# EAGLE design BTS_V2 (EAGLE 9.0.1)
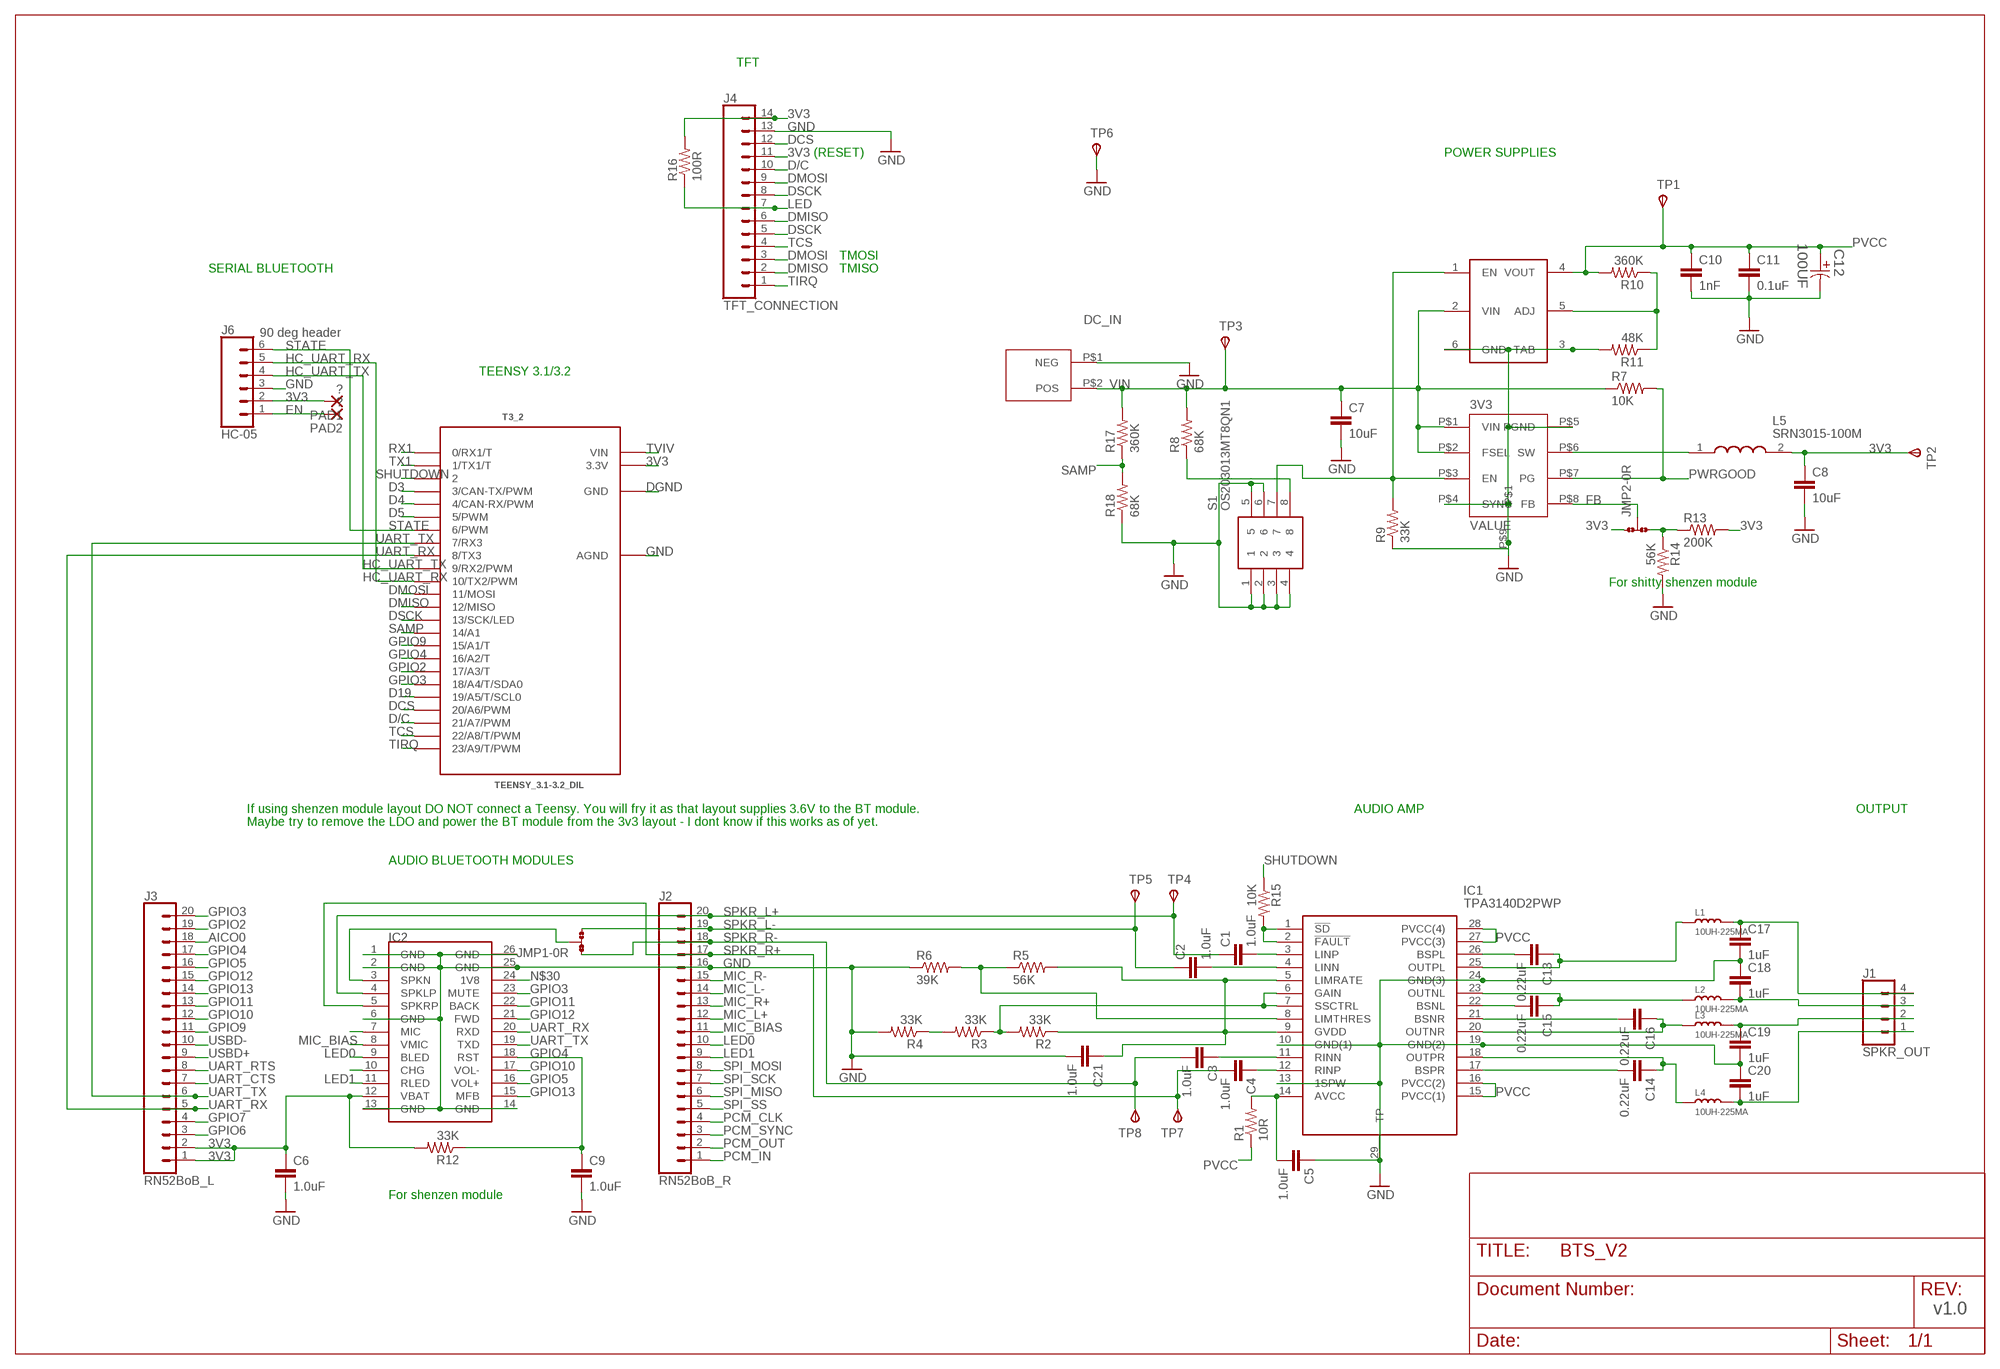
[diagram p0: schematic, sheet 1]

## Parts
3V3  ADP2370  [3MM_LFCSP_QFN]
C1  1.0uF  1.0UF-0603-16V-10%  [0603]
C2  1.0uF  1.0UF-0603-16V-10%  [0603]
C3  1.0uF  1.0UF-0603-16V-10%  [0603]
C4  1.0uF  1.0UF-0603-16V-10%  [0603]
C5  1.0uF  1.0UF-0603-16V-10%  [0603]
C6  1.0uF  1.0UF-0603-16V-10%  [0603]
C7  10uF  C-EUC3216  [C3216]
C8  10uF  C-EUC3216  [C3216]
C9  1.0uF  1.0UF-0603-16V-10%  [0603]
C10  1nF  1.0NF/1000PF-0603-50V-10%  [0603]
C11  0.1uF  0.1UF-0603-25V-(+80/-20%)  [0603]
C12  100UF  EEE-FK1C101P-CASE-D  [CAPAE660X610N]
C13  0.22uF  0.22UF-0603-50V-(-20/+80%)  [0603]
C14  0.22uF  0.22UF-0603-50V-(-20/+80%)  [0603]
C15  0.22uF  0.22UF-0603-50V-(-20/+80%)  [0603]
C16  0.22uF  0.22UF-0603-50V-(-20/+80%)  [0603]
C17  1uF  1.0NF/1000PF-0603-50V-10%  [0603]
C18  1uF  1.0NF/1000PF-0603-50V-10%  [0603]
C19  1uF  1.0NF/1000PF-0603-50V-10%  [0603]
C20  1uF  1.0NF/1000PF-0603-50V-10%  [0603]
C21  1.0uF  1.0UF-0603-16V-10%  [0603]
IC1  TPA3140D2PWP  [SOP65P640X120-29N]
IC2  BLK-MD-SPK-B  [BLK-MD-SPK-B]
J1  SPKR_OUT  CONN_04SCREW  [SCREWTERMINAL-3.5MM-4]
J2  RN52BoB_R  CONN_20  [1X20]
J3  RN52BoB_L  CONN_20  [1X20]
J4  TFT_CONNECTION  CONN_14  [1X14]
J6  HC-05  CONN_06SILK_FEMALE_PTH  [1X06]
JMP1  0R-JUMPA  [A0R-JMP]
JMP2  0R-JUMPA  [A0R-JMP]
L1  10UH-225MA  SMD-INDUCTOR-10UH-225MA-10%(0806)  [L0806]
L2  10UH-225MA  SMD-INDUCTOR-10UH-225MA-10%(0806)  [L0806]
L3  10UH-225MA  SMD-INDUCTOR-10UH-225MA-10%(0806)  [L0806]
L4  10UH-225MA  SMD-INDUCTOR-10UH-225MA-10%(0806)  [L0806]
L5  SRN3015-100M  [SRN3015]
PAD1  ?  SMD2  [SMD1,27-2,54]
PAD2  ?  SMD2  [SMD1,27-2,54]
R1  10R  R-US_R0603  [R0603]
R2  33K  R-US_R0603  [R0603]
R3  33K  R-US_R0603  [R0603]
R4  33K  R-US_R0603  [R0603]
R5  56K  R-US_R0603  [R0603]
R6  39K  R-US_R0603  [R0603]
R7  10K  R-US_R0603  [R0603]
R8  68K  R-US_R0603  [R0603]
R9  33K  R-US_R0603  [R0603]
R10  360K  R-US_R0603  [R0603]
R11  48K  R-US_R0603  [R0603]
R12  33K  R-US_R0603  [R0603]
R13  200K  R-US_R0603  [R0603]
R14  56K  R-US_R0603  [R0603]
R15  10K  R-US_R0603  [R0603]
R16  100R  R-US_R0603  [R0603]
R17  360K  R-US_R0603  [R0603]
R18  68K  R-US_R0603  [R0603]
S1  OS203013MT8QN1  [OS203013MT8QN1]
T3_2  TEENSY_3.1-3.2_DIL  [TEENSY_3.0-3.2&LC_DIL]
TP1  TPSPAD1-17  [P1-17]
TP2  TPSPAD1-17  [P1-17]
TP3  TPSPAD1-17  [P1-17]
TP4  TPSPAD1-17  [P1-17]
TP5  TPSPAD1-17  [P1-17]
TP6  TPSPAD1-17  [P1-17]
TP7  TPSPAD1-17  [P1-17]
TP8  TPSPAD1-17  [P1-17]
U$1  HK_XT-60  [HOBBYKING_XT-60]
U$2  NCP59302  [D2PAK-5]

## Nets
3V3: C6.1 C8.1 IC2.12(VBAT) J3.1 J3.2 J4.11 J4.14 J6.2 JMP2.1 L5.2 PAD1.1(P) R12.2 R13.2 R16.2 T3_2.3.3V TP2.TP(PP)
AICO0: J3.18
BSNL: C15.2 IC1.22(BSNL)
BSNR: C16.2 IC1.21(BSNR)
BSPL: C13.2 IC1.26(BSPL)
BSPR: C14.2 IC1.17(BSPR)
D3: T3_2.3(3/CAN-TX/PWM)
D4: T3_2.4(4/CAN-RX/PWM)
D5: T3_2.5(5/PWM)
D19: T3_2.19/A5(19/A5/T/SCL0)
D/C: J4.10 T3_2.21/A7(21/A7/PWM)
DCS: J4.12 T3_2.20/A6(20/A6/PWM)
DGND: T3_2.GND
DMISO: J4.2 J4.6 T3_2.12(12/MISO)
DMOSI: J4.3 J4.9 T3_2.11(11/MOSI)
DSCK: J4.5 J4.8 T3_2.13(13/SCK/LED)
EN: J6.1 PAD2.1(P)
FB: 3V3.P$8(FB) JMP2.2
GAIN: IC1.6(GAIN) IC1.7(SSCTRL) R2.2 R3.1
GND: 3V3.P$4(SYNC) 3V3.P$5(PGND) 3V3.P$9 C5.1 C6.2 C7.2 C8.2 C9.2 C10.2 C11.2 C12.2 C17.2 C18.1 C19.2 C20.1 C21.2 IC1.10(GND(1)) IC1.13(1SPW) IC1.19(GND(2)) IC1.24(GND(3)) IC1.29(TP) IC2.1(GND) IC2.2(GND) IC2.6(GND) IC2.13(GND) IC2.14(GND) IC2.25(GND) IC2.26(GND) J2.16 J4.13 J6.3 R4.2 R6.1 R9.1 R11.2 R14.2 R18.1 S1.1 S1.2 S1.3 S1.4 S1.5 S1.6 T3_2.AGND TP6.TP(PP) U$1.P$1(NEG) U$2.3(TAB) U$2.6(GND)
GPIO2: J3.19 T3_2.17/A3(17/A3/T)
GPIO3: IC2.23(MUTE) J3.20 T3_2.18/A4(18/A4/T/SDA0)
GPIO4: C9.1 IC2.18(RST) J3.17 R12.1 T3_2.16/A2(16/A2/T)
GPIO5: IC2.16(VOL+) J3.16
GPIO6: J3.3
GPIO7: J3.4
GPIO9: J3.11 T3_2.15/A1(15/A1/T)
GPIO10: IC2.17(VOL-) J3.12
GPIO11: IC2.22(BACK) J3.13
GPIO12: IC2.21(FWD) J3.15
GPIO13: IC2.15(MFB) J3.14
GVDD: C21.1 IC1.5(LIMRATE) IC1.9(GVDD) R2.1 R5.2
HC_UART_RX: J6.5 T3_2.10(10/TX2/PWM)
HC_UART_TX: J6.4 T3_2.9(9/RX2/PWM)
LED: J4.7 R16.1
LED0: IC2.9(BLED) J2.10
LED1: IC2.11(RLED) J2.9
LIMTHRES: IC1.8(LIMTHRES) R5.1 R6.2
LINN: C2.2 IC1.4(LINN)
LINP: C1.2 IC1.3(LINP)
MIC_BIAS: IC2.8(VMIC) J2.11
MIC_L+: J2.12
MIC_L-: J2.14
MIC_R+: J2.13
MIC_R-: J2.15
N$1: C5.2 IC1.14(AVCC) R1.2
N$2: IC1.1(!SD) IC1.2(!FAULT) R15.2
N$3: R3.2 R4.1
N$16: IC2.7(MIC)
N$19: C17.1 J1.4 L1.2
N$20: C18.2 J1.3 L2.2
N$21: C19.1 J1.2 L3.2
N$22: C20.2 J1.1 L4.2
N$23: JMP2.3 R13.1 R14.1
N$26: IC2.10(CHG)
N$28: IC2.3(SPKN) JMP1.2
N$30: IC2.24(1V8)
N$63: 3V3.P$3(EN) R9.2 S1.7 U$2.1(EN)
N$64: 3V3.P$6(SW) L5.1
N$65: R8.1 S1.8
N$66: R10.1 R11.1 U$2.5(ADJ)
OUTNL: C15.1 IC1.23(OUTNL) L2.1
OUTNR: C16.1 IC1.20(OUTNR) L3.1
OUTPL: C13.1 IC1.25(OUTPL) L1.1
OUTPR: C14.1 IC1.18(OUTPR) L4.1
PCM_CLK: J2.4
PCM_IN: J2.1
PCM_OUT: J2.2
PCM_SYNC: J2.3
PVCC: C10.1 C11.1 C12.1 IC1.15(PVCC(1)) IC1.16(PVCC(2)) IC1.27(PVCC(3)) IC1.28(PVCC(4)) R1.1 R10.2 TP1.TP(PP) U$2.4(VOUT)
PWRGOOD: 3V3.P$7(PG) R7.2
RINN: C3.1 IC1.11(RINN)
RINP: C4.1 IC1.12(RINP)
RX1: T3_2.0(0/RX1/T)
SAMP: R17.1 R18.2 T3_2.14/A0(14/A1)
SHUTDOWN: R15.1 T3_2.2
SPI_MISO: J2.6
SPI_MOSI: J2.8
SPI_SCK: J2.7
SPI_SS: J2.5
SPKR_L+: C1.1 IC2.4(SPKLP) J2.20 TP4.TP(PP)
SPKR_L-: C2.1 J2.19 JMP1.3 TP5.TP(PP)
SPKR_R+: C4.2 IC2.5(SPKRP) J2.17 TP7.TP(PP)
SPKR_R-: C3.2 J2.18 JMP1.1 TP8.TP(PP)
STATE: J6.6 T3_2.6(6/PWM)
TCS: J4.4 T3_2.22/A8(22/A8/T/PWM)
TIRQ: J4.1 T3_2.23/A9(23/A9/T/PWM)
TVIV: T3_2.VIN
TX1: T3_2.1(1/TX1/T)
UART_CTS: J3.7
UART_RTS: J3.8
UART_RX: IC2.20(RXD) J3.5 T3_2.8(8/TX3)
UART_TX: IC2.19(TXD) J3.6 T3_2.7(7/RX3)
USBD+: J3.9
USBD-: J3.10
VIN: 3V3.P$1(VIN) 3V3.P$2(FSEL) C7.1 R7.1 R8.2 R17.2 TP3.TP(PP) U$1.P$2(POS) U$2.2(VIN)

## Notes on the sheet
- TFT
- (RESET) | POWER SUPPLIES
- TMOSI
- SERIAL BLUETOOTH | TMISO
- DC_IN
- 90 deg header
- TEENSY 3.1/3.2
- For shitty shenzen module
- If using shenzen module layout DO NOT connect a Teensy. You will fry it as that layout supplies 3.6V to the BT module. | AUDIO AMP | OUTPUT
- Maybe try to remove the LDO and power the BT module from the 3v3 layout - I dont know if this works as of yet.
- AUDIO BLUETOOTH MODULES
- For shenzen module
- v1.0

## Library data of the parts
3V3 = myLib:ADP2370
C1-C6 C9 C21 = SparkFun-Capacitors:1.0UF: 1µF ceramic capacitors A capacitor is a passive two-terminal electrical component used to store electrical energy temporarily in an electric field.; PROD_ID: CAP-00868
C7 = rcl:C-EU: CAPACITOR, European symbol; SPICEPREFIX: 10uF
C8 = rcl:C-EU: CAPACITOR, European symbol; SPICEPREFIX: C
C10 = SparkFun-Capacitors:1.0NF/1000PF: 1nF/1,000pF ceramic capacitors A capacitor is a passive two-terminal electrical component used to store electrical energy temporarily in an electric field.; PROD_ID: CAP-07886
C11 = SparkFun-Capacitors:0.1UF: 0.1µF ceramic capacitors A capacitor is a passive two-terminal electrical component used to store electrical energy temporarily in an electric field.; PROD_ID: CAP-00810
C12 = Panasonic-EEEFK_EEEFP:EEE-: Aluminum Electrolytic Capacitors,Surface Mount Type; MPN: EEE-FK1C101P; OC_FARNELL: 9695672; OC_NEWARK: 80K9525; PACKAGE: CASE-D; SUPPLIER: PANASONIC; TOLERANCE: ±20 %; VOLTAGERATING: 16V
C13-C16 = SparkFun-Capacitors:0.22UF: 0.22µF ceramic capacitors A capacitor is a passive two-terminal electrical component used to store electrical energy temporarily in an electric field.; PROD_ID: CAP-09885
C17-C20 = SparkFun-Capacitors:1.0NF/1000PF: 1nF/1,000pF ceramic capacitors A capacitor is a passive two-terminal electrical component used to store electrical energy temporarily in an electric field.; PROD_ID: CAP-07886; VALUE: 1nF
IC1 = TPA3140D2PWP:TPA3140D2PWP: Audio Amplifiers 10W Class-D Audio Amp Source: Datasheet <http://www.mouser.com/ds/2/405/tpa3140d2-558212.pdf>; DESCRIPTION: Audio Amplifiers 10W Class-D Audio Amp; HEIGHT: 1.2mm; MANUFACTURER_NAME: Texas Instruments; MANUFACTURER_PART_NUMBER: TPA3140D2PWP; SUPPLIER_NAME: RS
IC2 = BLK-MD-SPK-B:BLK-MD-SPK-B
J1 = SparkFun-Connectors:CONN_04: Multi connection point. Often used as Generic Header-pin footprint for 0.1 inch spaced/style header connections On any of the 0.1 inch spaced packages, you can populate with these: Break Away Headers - Straight <https://www.sparkfun.com/products/116> (PRT-00116) Break Away Male Headers - Right Angle <https://www.sparkfun.com/products/553> (PRT-00553) Female Headers <https://www.sparkfun.com/products/115> (PRT-00115) Break Away Headers - Machine Pin <https://www.sparkfun.com/products/117> (PRT-00117) Break Away Female Headers - Swiss Machine Pin <https://www.sparkfun.com/products/743> (PRT-00743) For SCREWTERMINALS and SPRING TERMINALS visit here: Screw Terimnals on SparkFun.com <https://www.sparkfun.com/search/results?term=Screw+Terminals> (5mm/3.5mm/2.54mm spacing) This device is also useful as a general connection point to wire up your design to another part of your project. Our various solder wires solder well into these plated through hole pads. Hook-Up Wire - Assortment (Stranded, 22 AWG) <https://www.sparkfun.com/products/11375> (PRT-11375) Hook-Up Wire - Assortment (Solid Core, 22 AWG) <https://www.sparkfun.com/products/11367> (PRT-11367) View the entire wire category on our website here <https://www.sparkfun.com/categories/141> Special notes: Molex polarized connector foot print use with SKU : PRT-08231 with associated crimp pins and housings. 1MM SMD Version SKU: PRT-10208; PROD_ID: 2xCONN-08399; SF_ID: 2xPRT-08084
J2 J3 = SparkFun-Connectors:CONN_20: Multi connection point. Often used as Generic Header-pin footprint for 0.1 inch spaced/style header connections On any of the 0.1 inch spaced packages, you can populate with these: Break Away Headers - Straight <https://www.sparkfun.com/products/116> (PRT-00116) Break Away Male Headers - Right Angle <https://www.sparkfun.com/products/553> (PRT-00553) Female Headers <https://www.sparkfun.com/products/115> (PRT-00115) Break Away Headers - Machine Pin <https://www.sparkfun.com/products/117> (PRT-00117) Break Away Female Headers - Swiss Machine Pin <https://www.sparkfun.com/products/743> (PRT-00743) For SCREWTERMINALS and SPRING TERMINALS visit here: Screw Terimnals on SparkFun.com <https://www.sparkfun.com/search/results?term=Screw+Terminals> (5mm/3.5mm/2.54mm spacing) This device is also useful as a general connection point to wire up your design to another part of your project. Our various solder wires solder well into these plated through hole pads. Hook-Up Wire - Assortment (Stranded, 22 AWG) <https://www.sparkfun.com/products/11375> (PRT-11375) Hook-Up Wire - Assortment (Solid Core, 22 AWG) <https://www.sparkfun.com/products/11367> (PRT-11367) View the entire wire category on our website here <https://www.sparkfun.com/categories/141> Special notes: Molex polarized connector foot print use with SKU : PRT-08231 with associated crimp pins and housings. 1MM SMD Version SKU: PRT-10208 NOTES ON THE VARIANTS LOCK and LOCK_LONGPADS... This footprint was designed to help hold the alignment of a through-hole component (i.e. 6-pin header) while soldering it into place. You may notice that each hole has been shifted either up or down by 0.005 of an inch from it's more standard position (which is a perfectly straight line). This slight alteration caused the pins (the squares in the middle) to touch the edges of the holes. Because they are alternating, it causes a "brace" to hold the component in place. 0.005 has proven to be the perfect amount of "off-center" position when using our standard breakaway headers. Although looks a little odd when you look at the bare footprint, once you have a header in there, the alteration is very hard to notice. Also,if you push a header all the way into place, it is covered up entirely on the bottom side. Note about LOCK SPECIAL package: This is just like the LOCK variant in that the holes are staggared by 5 mil, but except for the last two holes. They are not altered from the "standard" footprint layout. This is used for a special purpose on the layout of our Graphic LCD Backpack. Make sure you want to use this device before selecting it for you project!
J4 = SparkFun-Connectors:CONN_14: Multi connection point. Often used as Generic Header-pin footprint for 0.1 inch spaced/style header connections On any of the 0.1 inch spaced packages, you can populate with these: Break Away Headers - Straight <https://www.sparkfun.com/products/116> (PRT-00116) Break Away Male Headers - Right Angle <https://www.sparkfun.com/products/553> (PRT-00553) Female Headers <https://www.sparkfun.com/products/115> (PRT-00115) Break Away Headers - Machine Pin <https://www.sparkfun.com/products/117> (PRT-00117) Break Away Female Headers - Swiss Machine Pin <https://www.sparkfun.com/products/743> (PRT-00743) For SCREWTERMINALS and SPRING TERMINALS visit here: Screw Terimnals on SparkFun.com <https://www.sparkfun.com/search/results?term=Screw+Terminals> (5mm/3.5mm/2.54mm spacing) This device is also useful as a general connection point to wire up your design to another part of your project. Our various solder wires solder well into these plated through hole pads. Hook-Up Wire - Assortment (Stranded, 22 AWG) <https://www.sparkfun.com/products/11375> (PRT-11375) Hook-Up Wire - Assortment (Solid Core, 22 AWG) <https://www.sparkfun.com/products/11367> (PRT-11367) View the entire wire category on our website here <https://www.sparkfun.com/categories/141> Special notes: Molex polarized connector foot print use with SKU : PRT-08231 with associated crimp pins and housings. 1MM SMD Version SKU: PRT-10208 NOTES ON THE VARIANTS LOCK and LOCK_LONGPADS... This footprint was designed to help hold the alignment of a through-hole component (i.e. 6-pin header) while soldering it into place. You may notice that each hole has been shifted either up or down by 0.005 of an inch from it's more standard position (which is a perfectly straight line). This slight alteration caused the pins (the squares in the middle) to touch the edges of the holes. Because they are alternating, it causes a "brace" to hold the component in place. 0.005 has proven to be the perfect amount of "off-center" position when using our standard breakaway headers. Although looks a little odd when you look at the bare footprint, once you have a header in there, the alteration is very hard to notice. Also,if you push a header all the way into place, it is covered up entirely on the bottom side.
J6 = SparkFun-Connectors:CONN_06: Multi connection point. Often used as Generic Header-pin footprint for 0.1 inch spaced/style header connections On any of the 0.1 inch spaced packages, you can populate with these: Break Away Headers - Straight <https://www.sparkfun.com/products/116> (PRT-00116) Break Away Male Headers - Right Angle <https://www.sparkfun.com/products/553> (PRT-00553) Female Headers <https://www.sparkfun.com/products/115> (PRT-00115) Break Away Headers - Machine Pin <https://www.sparkfun.com/products/117> (PRT-00117) Break Away Female Headers - Swiss Machine Pin <https://www.sparkfun.com/products/743> (PRT-00743) Arduino Stackable Header - 6 Pin <https://www.sparkfun.com/products/9280> (PRT-09280) For SCREWTERMINALS and SPRING TERMINALS visit here: Screw Terimnals on SparkFun.com <https://www.sparkfun.com/search/results?term=Screw+Terminals> (5mm/3.5mm/2.54mm spacing) This device is also useful as a general connection point to wire up your design to another part of your project. Our various solder wires solder well into these plated through hole pads. Hook-Up Wire - Assortment (Stranded, 22 AWG) <https://www.sparkfun.com/products/11375> (PRT-11375) Hook-Up Wire - Assortment (Solid Core, 22 AWG) <https://www.sparkfun.com/products/11367> (PRT-11367) View the entire wire category on our website here <https://www.sparkfun.com/categories/141>; PROD_ID: CONN-08437
JMP1 JMP2 = jump-0r-smd:0R-JUMP: SMD 0R 0805 Jumper
L1-L4 = Seeed-Inductor:SMD-INDUCTOR-10UH-225MA-10%(0806): 303010042; MPN: LQH2MCN100K02L
L5 = SRN3015-100M:SRN3015-100M: Power Inductor semi-shielded SMD 10uH Bourns SRN3015 Series Shielded Wire-wound SMD Inductor with a Ferrite Core, 10 H 20% Wire-Wound 1A Idc Source: Datasheet <https://componentsearchengine.com/Datasheets/3/SRN3015-100M.pdf>; DESCRIPTION: Power Inductor semi-shielded SMD 10uH Bourns SRN3015 Series Shielded Wire-wound SMD Inductor with a Ferrite Core, 10 H 20% Wire-Wound 1A Idc; HEIGHT: mm; MANUFACTURER_NAME: Bourns; MANUFACTURER_PART_NUMBER: SRN3015-100M; RS_PART_NUMBER: 7435071; SUPPLIER_NAME: RS
PAD1 PAD2 = wirepad:SMD2: SMD PAD
R1 = resistor:R-US_: RESISTOR, American symbol; RESISTANCE: 10R
R2-R4 R9 R12 R15 = resistor:R-US_: RESISTOR, American symbol; RESISTANCE: 33K
R5 = resistor:R-US_: RESISTOR, American symbol; RESISTANCE: 56K
R6 = resistor:R-US_: RESISTOR, American symbol; RESISTANCE: 39K
R7 R10 R11 R13 R14 = resistor:R-US_: RESISTOR, American symbol; RESISTANCE: 10K
R8 R17 R18 = resistor:R-US_: RESISTOR, American symbol; RESISTANCE: 68K
R16 = resistor:R-US_: RESISTOR, American symbol
S1 = OS203013MT8QN1:OS203013MT8QN1: OS Series Miniature Slide Switches, DP3T. Source: Datasheet <http://www.ckswitches.com/media/1428/os.pdf>; DESCRIPTION: OS Series Miniature Slide Switches, DP3T.; HEIGHT: mm; MANUFACTURER_NAME: C & K COMPONENTS; MANUFACTURER_PART_NUMBER: OS203013MT8QN1; SUPPLIER_NAME: RS
T3_2 = Teensy_3_and_LC_Series_Boards_v1.4:TEENSY_3.1-3.2_DIL: Teensy 3.1 or 3.2 in a DIL Layout.
TP1-TP8 = testpad:TPS: TEST PIN
U$1 = myLib:HK_XT-60
U$2 = myLib:NCP59302

## Board
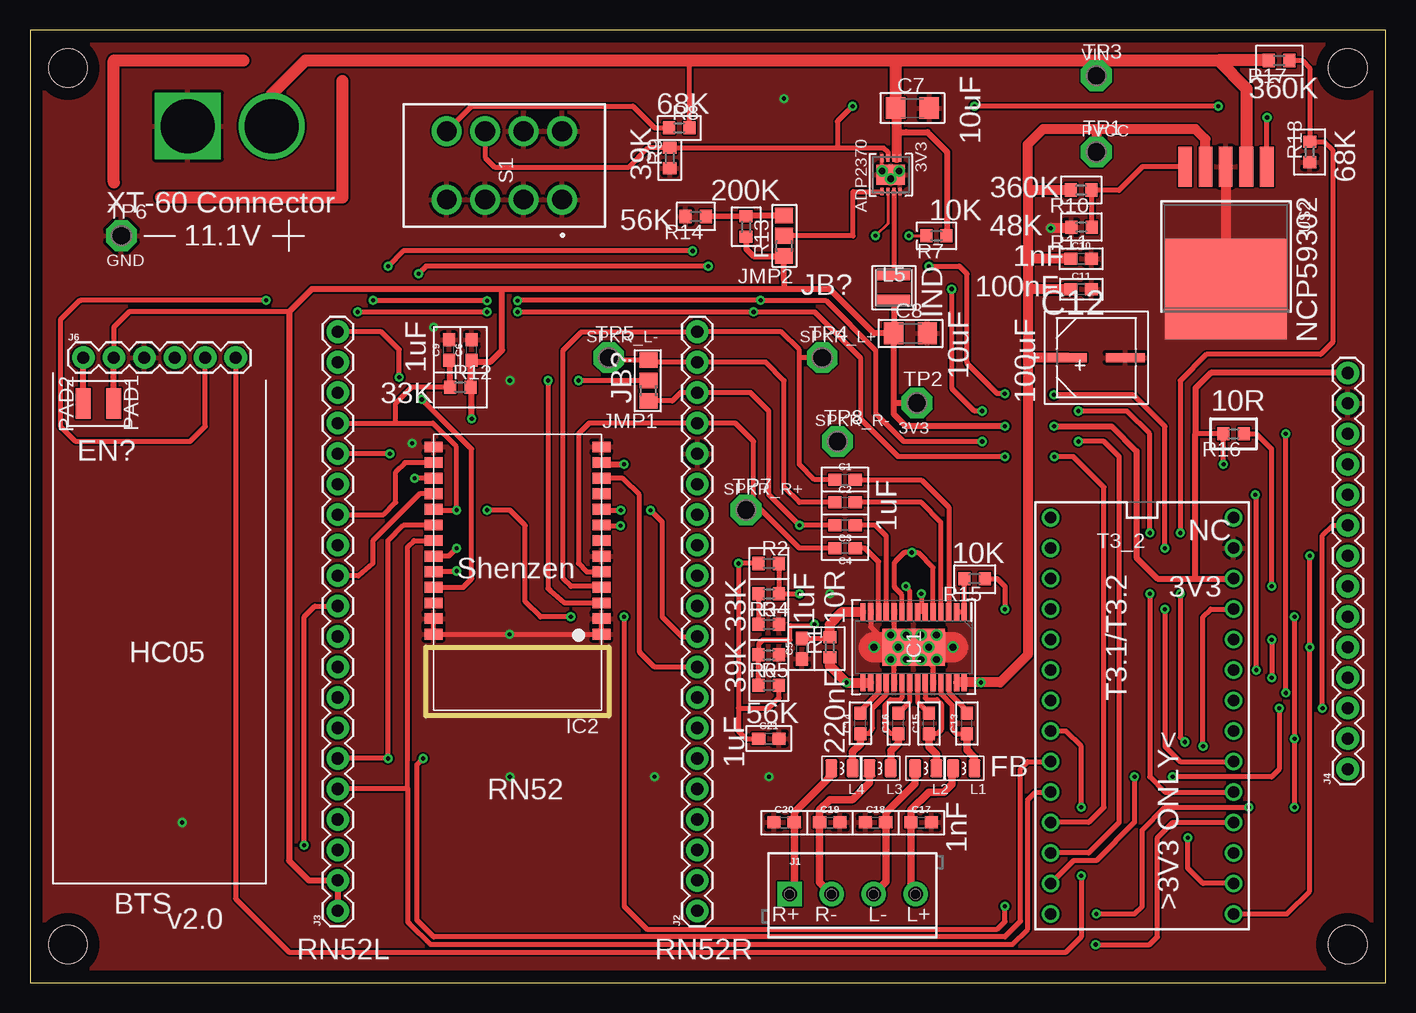
[diagram p1: board, top side]
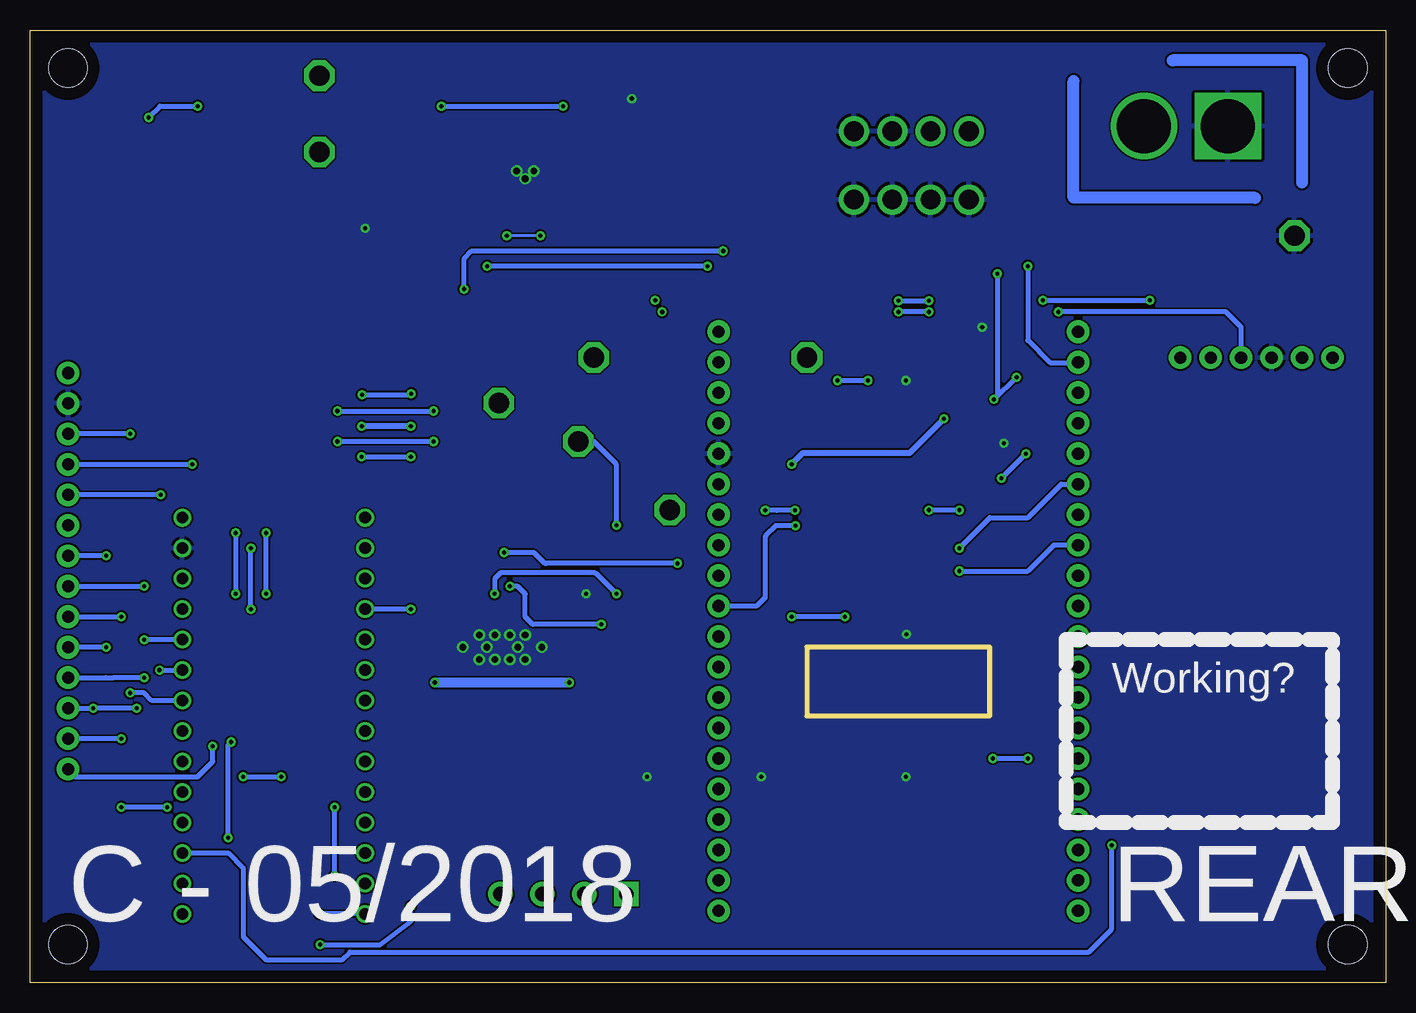
[diagram p2: board, bottom side, seen from below]

Size 113.03 x 79.38 mm. Coordinates in mm from the lower left corner, seen from the top.
Outline: 0,0 113.03,0 113.03,79.38 0,79.38 0,0
Copper layers (1*16): Top 0.035mm / dielectric 1.5mm / Bottom 0.035mm
Design rules "PCBCart *": minimum track width 6mil, minimum drill 8mil, track to track 6mil, track to pad 6mil, pad to pad 6mil, via to via 6mil, smd to smd 6mil, copper to edge 40mil, drill to drill 6mil, minimum pad ring 10mil, minimum via ring 8mil, stop-mask expansion 5mil, vias tented up to drill 0mil, thermal gap 10mil
Holes 3.2 mm at 3.17,76.2 109.86,76.2 3.17,3.17 109.86,3.17
Milling: area 33,22.2 to 48.3,27.9

### Footprints (pad centres in the part's own frame; a part is rotated, then mirrored left to right if it is on the bottom)
3MM_LFCSP_QFN = smd 0.6 x 0.25: P$1 -1.4,0.75; P$2 -1.4,0.25; P$3 -1.4,-0.25; P$4 -1.4,-0.75; P$5 1.4,0.75; P$6 1.4,0.25; P$7 1.4,-0.25; P$8 1.4,-0.75 | smd 1.64 x 2.38: P$9 0,0
0603 = smd 1.1 x 1: 1 -0.85,0; 2 0.85,0
C3216 = smd 1.6 x 1.8: 1 -1.4,0; 2 1.4,0
CAPAE660X610N = smd 3.251 x 0.762: 1 -2.413,0; 2 2.413,0
SOP65P640X120-29N = smd 1.475 x 0.45: 1 -2.938,4.225; 2 -2.938,3.575; 3 -2.938,2.925; 4 -2.938,2.275; 5 -2.938,1.625; 6 -2.938,0.975; 7 -2.938,0.325; 8 -2.938,-0.325; 9 -2.938,-0.975; 10 -2.938,-1.625; 11 -2.938,-2.275; 12 -2.938,-2.925; 13 -2.938,-3.575; 14 -2.938,-4.225; 15 2.938,-4.225; 16 2.938,-3.575; 17 2.938,-2.925; 18 2.938,-2.275; 19 2.938,-1.625; 20 2.938,-0.975; 21 2.938,-0.325; 22 2.938,0.325; 23 2.938,0.975; 24 2.938,1.625; 25 2.938,2.275; 26 2.938,2.925; 27 2.938,3.575; 28 2.938,4.225 | smd 3.1 x 5.18: 29 0,0
BLK-MD-SPK-B = smd 1.5 x 0.9: 1 -7,7.8; 2 -7,6.5; 3 -7,5.2; 4 -7,3.9; 5 -7,2.6; 6 -7,1.3; 7 -7,0; 8 -7,-1.3; 9 -7,-2.6; 10 -7,-3.9; 11 -7,-5.2; 12 -7,-6.5; 13 -7,-7.8; 14 7,-7.8; 15 7,-6.5; 16 7,-5.2; 17 7,-3.9; 18 7,-2.6; 19 7,-1.3; 20 7,0; 21 7,1.3; 22 7,2.6; 23 7,3.9; 24 7,5.2; 25 7,6.5; 26 7,7.8
SCREWTERMINAL-3.5MM-4 = drill 1.2 pad 2.032 square: 1 0,0 | drill 1.2 pad 2.032: 2 3.5,0; 3 7,0; 4 10.5,0
1X20 = drill 1.016 pad 1.88: 1 0,0; 2 2.54,0; 3 5.08,0; 4 7.62,0; 5 10.16,0; 6 12.7,0; 7 15.24,0; 8 17.78,0; 9 20.32,0; 10 22.86,0; 11 25.4,0; 12 27.94,0; 13 30.48,0; 14 33.02,0; 15 35.56,0; 16 38.1,0; 17 40.64,0; 18 43.18,0; 19 45.72,0; 20 48.26,0
1X14 = drill 1.016 pad 1.88: 1 0,0; 2 2.54,0; 3 5.08,0; 4 7.62,0; 5 10.16,0; 6 12.7,0; 7 15.24,0; 8 17.78,0; 9 20.32,0; 10 22.86,0; 11 25.4,0; 12 27.94,0; 13 30.48,0; 14 33.02,0
1X06 = drill 1.016 pad 1.88: 1 0,0; 2 2.54,0; 3 5.08,0; 4 7.62,0; 5 10.16,0; 6 12.7,0
A0R-JMP = smd 1.5 x 1.3: 1 0,1.7; 2 0,0; 3 0,-1.7
L0806 = smd 1.016 x 1.524: 1 -0.889,0; 2 0.889,0
SRN3015 = smd 2.7 x 1: 1 0,-1.1; 2 0,1.1
SMD1,27-2,54 = smd 1.27 x 2.54: 1 0,0
R0603 = smd 1 x 1.1: 1 -0.85,0; 2 0.85,0
OS203013MT8QN1 = drill 1.65 pad 2.5: 1 -2.85,-4.8; 2 -2.85,-1.6; 3 -2.85,1.6; 4 -2.85,4.8; 5 2.85,-4.8; 6 2.85,-1.6; 7 2.85,1.6; 8 2.85,4.8
TEENSY_3.0-3.2&LC_DIL = drill 0.965: 0 -7.62,13.97; 1 -7.62,11.43; 2 -7.62,8.89; 3 -7.62,6.35; 3.3V 7.62,11.43; 4 -7.62,3.81; 5 -7.62,1.27; 6 -7.62,-1.27; 7 -7.62,-3.81; 8 -7.62,-6.35; 9 -7.62,-8.89; 10 -7.62,-11.43; 11 -7.62,-13.97; 12 -7.62,-16.51; 13 7.62,-16.51; 14/A0 7.62,-13.97; 15/A1 7.62,-11.43; 16/A2 7.62,-8.89; 17/A3 7.62,-6.35; 18/A4 7.62,-3.81; 19/A5 7.62,-1.27; 20/A6 7.62,1.27; 21/A7 7.62,3.81; 22/A8 7.62,6.35; 23/A9 7.62,8.89; AGND 7.62,13.97; GND -7.62,16.51; VIN 7.62,16.51
P1-17 = drill 1.702 pad 2.54 octagon: TP 0,0
HOBBYKING_XT-60 = drill 4.5 square: P$1 0,0 | drill 4.5: P$2 7,0
D2PAK-5 = smd 1.143 x 3.302: 1 -3.404,-7.658; 2 -1.702,-7.658; 4 1.702,-7.658; 5 3.404,-7.658; 6 0.025,-7.658 | smd 10.16 x 8.382: 3 0,2.54

### Placement (x,y rotation side)
3V3  71.75,67.31 270 top
C1  67.94,41.91 0 top
C2  67.94,40.01 0 top
C3  67.94,38.1 180 top
C4  67.94,36.2 180 top
C5  64.36,27.81 90 top
C6  36.83,52.7 90 top
C7  73.56,72.87 0 top
C8  73.41,54.1 0 top
C9  34.92,52.7 90 top
C10  87.63,60.33 0 top
C11  87.63,57.78 0 top
C12  88.9,52.07 0 top
C13  78.11,21.59 90 top
C14  69.22,21.59 90 top
C15  74.93,21.59 90 top
C16  72.39,21.59 90 top
C17  74.3,13.34 0 top
C18  70.48,13.34 0 top
C19  66.67,13.34 0 top
C20  62.87,13.34 0 top
C21  61.59,20.32 0 top
IC1  73.66,27.94 270 top
IC2  40.64,36.83 180 top
J1  63.32,7.37 0 top
J2  55.63,5.97 90 top
J3  25.65,5.97 90 top
J4  109.86,17.78 90 top
J6  4.45,52.07 0 top
JMP1  51.56,50.16 180 top
JMP2  62.87,62.23 180 top
L1  77.85,17.86 180 top
L2  74.68,17.86 180 top
L3  70.87,17.86 180 top
L4  67.69,17.86 180 top
L5  72.01,57.91 180 top
PAD1  6.99,48.26 180 top
PAD2  4.45,48.26 0 top
R1  66.67,27.94 90 top
R2  61.59,34.92 0 top
R3  61.59,32.38 180 top
R4  61.59,29.84 0 top
R5  61.59,24.77 0 top
R6  61.59,27.3 180 top
R7  75.56,62.23 180 top
R8  54.13,71.22 0 top
R9  53.34,68.71 90 top
R10  87.63,66.04 180 top
R11  87.66,62.94 180 top
R12  35.86,49.61 0 top
R13  59.69,62.99 270 top
R14  55.5,63.83 180 top
R15  78.74,33.66 180 top
R16  100.33,45.72 180 top
R17  104.14,76.83 180 top
R18  106.68,69.22 90 top
S1  39.55,68.1 90 top
T3_2  92.71,22.23 0 top
TP1  88.9,69.22 0 top
TP2  73.94,48.29 0 top
TP3  88.9,75.56 0 top
TP4  66.04,52.07 0 top
TP5  48.26,52.07 0 top
TP6  7.62,62.23 0 top
TP7  59.69,39.37 0 top
TP8  67.31,45.09 0 top
U$1  13.16,71.37 0 top
U$2  99.69,60.33 180 top

### Tracks (layer width: path | path; a pad name or v marks a point on that pad's centre or on a via)
3V3  (via drill 0.35)
  Top 0.254: C8.1
  Top 0.406: JMP2.1 62.87,60.33 | 62.87,58.51 62.91,58.46 | 97.16,45.72 R16.2 99.48,44.66 v99.49,43.18 | J6.2 6.99,54.61 8.26,55.88 21.59,55.88
  Top 0.508: L5.2 C8.1 | 39.37,57.78 23.5,57.78 21.59,55.88 21.59,10.16 23.24,8.51 J3.2 J3.1 | PAD1.1 J6.2 | IC2.12 47.79,43.18 v49.53,43.18 | v36.83,46.99 36.83,49.49 R12.2 36.72,51.74 | 36.72,51.74 C6.1 | 36.72,51.74 38.41,51.74 39.37,52.7 39.37,57.78 | v85.37,46.35 90.17,46.35 92.24,44.29 92.24,35.4 93.98,33.66 97.16,33.66 | 62.87,57.78 66.67,57.78 70.36,54.1 C8.1 72.01,48.26 | 62.87,57.78 39.37,57.78 | 62.87,57.78 62.87,58.51 62.87,60.33 | R13.2 59.69,61.16 60.33,60.53 JMP2.1 | v81.28,46.35 73.03,46.35 72.01,47.37 72.01,48.26 | 97.16,33.66 T3_2.3.3V | 97.16,33.66 97.16,45.72 97.16,49.53 98.42,50.8 J4.14 | TP2.TP 73.91,48.26 72.01,48.26
  Bottom 0.406: J4.11 v99.49,43.18
  Bottom 0.508: v49.53,43.18 48.58,44.13 39.69,44.13 v36.83,46.99 | v81.28,46.35 v85.37,46.35
BSNL
  Top 0.406: IC1.22 73.98,23.39 C15.2
BSNR
  Top 0.406: C16.2 73.26,23.31 arc45 73.33,23.49 IC1.21
BSPL
  Top 0.406: IC1.26 76.61,24.98 76.61,24.16 78.11,22.67 C13.2
BSPR
  Top 0.406: IC1.17 70.71,24.98 70.71,24.16 69.22,22.67 C14.2
D/C  (via drill 0.35)
  Top 0.406: v102.23,26.04 102.23,40.54 v102.14,40.64
  Bottom 0.406: 100.97,26.04 T3_2.21/A7 v102.23,26.04 | v102.14,40.64 J4.10
DCS  (via drill 0.35)
  Top 0.406: v104.67,45.72 v104.68,45.72 v104.68,24.13
  Bottom 0.406: T3_2.20/A6 102.87,23.5 103.5,24.13 v104.68,24.13 | v104.67,45.72 J4.12
DMISO  (via drill 0.35)
  Top 0.406: v88.9,5.71 92.08,5.71 92.71,6.35 92.71,12.7 94.61,14.61 v101.6,14.61 | v105.41,30.48 v105.41,20.32 v105.41,14.61
  Bottom 0.406: T3_2.12 v88.9,5.71 | J4.6 v105.41,30.48 | v101.6,14.61 v105.41,14.61 | v105.41,20.32 J4.2
DMOSI  (via drill 0.35)
  Top 0.406: v104.14,22.86 104.14,17.78 103.5,17.14 v95.25,17.14 | v92.08,17.14 92.08,13.34 88.9,10.16 87,10.16 T3_2.11 | J4.9 108.58,38.1 107.75,37.26 v107.75,22.86
  Bottom 0.406: v95.25,17.14 v92.08,17.14 | v104.14,22.86 v107.75,22.86 J4.3
DSCK  (via drill 0.35)
  Top 0.406: T3_2.13 104.78,5.71 106.68,7.62 v106.68,27.94 v106.68,35.56
  Bottom 0.406: v106.68,27.94 J4.5 | v106.68,35.56 J4.8
EN
  Top 0.508: PAD2.1 J6.1
FB
  Top 0.406: JMP2.2 68.61,62.23 68.62,65.9 68.63,65.91 3V3.P$8
GAIN  (via drill 0.35)
  Top 0.406: v64.14,32.38 R3.1 R2.2 | v74.3,32.38 74.3,31.22 IC1.6 IC1.7
  Bottom 0.406: v74.3,32.38 74.3,33.63 73.79,34.14 65.99,34.14 arc45 65.81,34.06 v64.14,32.38
GND  (via drill 0.35, 0.55)
  Top 0.152: 72.03,26.04 72.03,26.32 IC1.29 72.03,29.57 72.03,29.84
  Top 0.254: v71.75,66.98 v71.04,67.64 | v71.75,66.98 72.39,67.31 v72.47,67.64 72.51,67.31 72.46,66.58 v71.75,66.98 | v71.75,66.98 71,68.06 3V3.P$4 | 3V3.P$5 72.51,65.91
  Top 0.406: IC1.19 72.03,26.04 72.03,26.35 | IC1.10 72.03,29.84 72.03,29.53 | IC1.13 70.08,29.61 71.29,28.41 | IC1.24 75.28,26.35 73.69,27.94 IC1.29 | IC2.2 IC2.1 IC2.26 IC2.25 33.79,30.48 | IC1.29 v73.03,28.96 | IC1.29 v74.3,28.96 | IC1.29 v74.93,27.94 | IC1.29 v73.03,26.92 | IC1.29 v74.3,26.92 | 72.5,67.19 72.39,67.31 | 71,67.37 v71.04,67.64
  Top 0.813: R11.2 86.73,62.87 v85.09,62.87 | U$2.6 99.67,61.62 99.69,61.59 U$2.3
  Top 2.54: v76.94,27.94 IC1.29 v70.36,27.94
  other vias: 71.75,28.96 71.75,26.92 72.36,27.94 75.56,28.96 75.56,26.92 12.7,13.34 31.85,44.93 33.66,54.61 61.59,17.14 66.67,32.38 40.01,17.14 62.87,73.66 40.01,50.16 52.07,17.14 39.98,29.03
  pour Top: 0,79.38 113.03,79.38 113.03,0 0,0
  pour Bottom: 0,79.38 0,0 113.03,0 113.03,79.38
  pour Top: 69.85,29.46 77.47,29.46 77.47,26.42 69.85,26.42
GPIO2  (via drill 0.35)
  Top 0.406: v55.24,60.96 31.11,60.96 v29.84,59.69 | v87.4,47.62 91.44,47.62 93.34,45.72 v93.34,37.47 | v93.34,32.38 93.34,17.14 94.61,15.88 T3_2.17/A3 | v79.38,47.62 78.74,47.62 76.91,49.46 arc-45 76.83,49.63 v76.83,57.78
  Bottom 0.406: v29.84,59.69 29.84,53.52 27.99,51.66 25.68,51.66 J3.19 | v93.34,32.38 v93.34,37.47 | v55.24,60.96 76.2,60.96 76.83,60.33 v76.83,57.78 | v87.4,47.62 v79.38,47.62
GPIO3  (via drill 0.35)
  Top 0.406: IC2.23 36.1,32.93 36.83,33.66 36.83,44.45 v32.66,48.59 | v30.79,50.44 30.79,52.73 29.29,54.23 J3.20 | v56.54,59.69 34.29,59.69 33.02,59.69 v32.38,59.05 | v85.34,48.97 92,48.97 94.61,46.35 v94.61,36.2 | v74.93,59.69 v74.94,59.69 77.47,59.69 78.11,59.05 78.11,51.72 arc45 78.18,51.54 80.64,49.07 v81.25,49.07 | v94.61,31.11 94.61,19.68 95.89,18.41 T3_2.18/A4
  Bottom 0.406: v30.79,50.44 v32.66,48.59 32.37,48.88 v32.38,59.05 | v94.61,31.11 v94.61,36.2 | v56.54,59.69 v74.93,59.69 | v85.34,48.97 81.36,48.97 v81.25,49.07
GPIO4  (via drill 0.35)
  Top 0.406: IC2.18 33.7,39.37 v35.56,39.37 35.56,44.3 | 35.56,44.3 35.56,44.55 | 35.56,44.3 35.56,44.63 33.58,46.61 30.48,46.61 | v45.09,30.48 42.55,30.48 41.27,31.75 41.27,38.1 40.01,39.37 v38.1,39.37 | v49.53,30.48 49.53,6.35 51.44,4.45 80.64,4.45 81.28,5.08 v81.28,6.35 | T3_2.16/A2 95.25,13.34 93.98,12.06 93.98,3.81 93.33,3.16 v88.84,3.16 | J3.17 30.48,46.61 | 30.48,46.61 30.48,48.26 31.83,49.61 R12.1
  Top 0.508: R12.1 35.02,51.77 C9.1
  Bottom 0.406: v35.56,39.37 v38.1,39.37 | v45.09,30.48 v49.53,30.48 | v88.84,3.16 83.83,3.16 81.28,5.08 v81.28,6.35
GPIO5  (via drill 0.35)
  Top 0.406: IC2.16 32.07,42.03 v32.05,42.01 | v30,44.07 J3.16
  Bottom 0.406: v32.05,42.01 v30,44.07
GPIO9  (via drill 0.35)
  Top 0.406: v22.86,11.43 22.86,30.48 23.75,31.37 J3.11
  Bottom 0.406: T3_2.15/A1 96.52,10.79 95.25,9.53 95.25,3.81 93.34,1.91 87,1.91 86.36,2.54 24.77,2.54 22.86,4.45 v22.86,11.43
GPIO10
  Top 0.406: IC2.17 33.55,40.72 32.46,40.72 31.77,40.02 28.57,36.8 28.57,34.9 27.38,33.88 26.67,33.91 J3.12
GPIO11  (via drill 0.35)
  Top 0.406: IC2.22 33.7,34.29 v35.56,34.29
  Bottom 0.406: v35.56,34.29 29.84,34.29 27.69,36.45 J3.13 26.42,36.45
GPIO12  (via drill 0.35)
  Top 0.406: IC2.21 33.67,35.56 34.92,35.56 v35.56,36.2
  Bottom 0.406: v35.56,36.2 33.02,38.73 29.84,38.73 27.05,41.53 J3.15
GPIO13
  Top 0.406: IC2.15 31.27,43.33 30.48,42.55 30.48,40.01 29.46,38.99 J3.14
GVDD  (via drill 0.35)
  Top 0.406: IC1.5 75.29,34.57 74.02,35.84 v73.51,35.84 72.97,35.84 arc45 72.8,35.76 72.13,35.1 arc45 72.06,34.92 72.06,33.03 arc45 72.13,32.85 72.69,32.3 IC1.9 | R2.1 v59.05,34.92 59.05,22.86 | 59.05,22.86 59.05,20.95 59.69,20.32 C21.1 | 59.05,22.86 61.59,22.86 62.45,23.71 R5.2
  Bottom 0.406: v59.05,34.92 70.01,34.92 arc45 70.19,35 70.95,35.76 arc-45 71.13,35.84 v73.51,35.84
HC_UART_RX  (via drill 0.35)
  Top 0.406: T3_2.10 88.27,10.79 90.81,13.34 90.81,43.81 89.53,45.09 v87.4,45.09 | v40.64,56.82 40.62,56.84 v60.91,56.84 66.34,56.84 70.48,52.7 70.48,47.42 72.82,45.09 v79.38,45.09 | v38.1,56.82 28.63,56.82 v28.6,56.84 | v19.68,56.84 4.25,56.84 arc45 4.07,56.77 2.54,55.24 2.54,46.35 3.74,45.16 arc45 3.92,45.09 13.23,45.09 arc45 13.41,45.16 14.61,46.35 J6.5
  Bottom 0.406: v40.64,56.82 v38.1,56.82 | v87.4,45.09 v79.38,45.09 | v28.6,56.84 v19.68,56.84
HC_UART_TX  (via drill 0.35)
  Top 0.406: v27.3,55.88 v38.1,55.88 | v40.64,55.88 v60.33,55.88 65.41,55.88 69.22,52.07 69.22,46.99 72.39,43.81 v81.28,43.81 | T3_2.9 88.27,13.34 89.53,14.61 89.53,41.27 87,43.81 v85.39,43.81
  Bottom 0.406: v38.1,55.88 v40.64,55.88 | v27.3,55.88 13.34,55.88 12.06,54.61 J6.4 | v85.39,43.81 v81.28,43.81
LED  (via drill 0.35)
  Top 0.406: R16.1 102.23,45.72 103.5,44.45 v103.5,33.02
  Bottom 0.406: J4.7 v103.5,33.02
LED0  (via drill 0.35)
  Top 0.406: IC2.9 47.73,39.34 v49.25,39.34 | v51.74,39.34 52.7,38.38 52.7,30.48 54.36,28.83 J2.10
  Bottom 0.406: v49.25,39.34 50.8,39.34 v51.74,39.34
LED1
  Top 0.406: J2.9 52.07,26.29 50.87,27.48 arc-45 50.8,27.66 50.8,40.64 49.48,41.96 arc45 49.3,42.03 IC2.11
LIMTHRES  (via drill 0.35)
  Top 0.406: v73.03,33.02 73.33,32.64 IC1.8 | R5.1 R6.2 60.78,27.34 60.78,28.25 61.09,28.55 63.37,28.55 63.37,29.72 63.4,29.74 65.3,29.74 v65.41,29.84
  Bottom 0.406: v73.03,33.02 72.39,33.02 71.75,32.38 71.75,30.48 71.12,29.84 v65.41,29.84
LINN
  Top 0.406: C2.2 74.3,40.01 75.94,38.37 IC1.4
LINP
  Top 0.406: IC1.3 76.58,39.62 74.35,41.85 68.85,41.85 C1.2
MIC_BIAS  (via drill 0.35)
  Top 0.406: IC2.8 47.7,38.08 v49.23,38.08
  Bottom 0.406: v49.23,38.08 50.85,38.08 51.66,37.26 arc-45 51.74,37.08 51.74,32.19 arc45 51.81,32.01 52.38,31.44 arc45 52.56,31.37 J2.11
N$1
  Top 0.152: IC1.14 68.58,30.88
  Top 0.406: R1.2 66.55,28.66 C5.2
  Top 0.813: R1.2 66.67,29.84 67.71,30.88 68.58,30.88 69.3,30.88
N$2
  Top 0.406: R15.2 IC1.1 IC1.2
N$3
  Top 0.406: R3.2 R4.1
N$15
  Bottom 1.016: 6.99,66.67 6.99,76.83 17.78,76.83
N$17
  Bottom 1.016: 10.9,65.38 26.04,65.41 26.04,75.11
N$19
  Top 0.508: L1.2 arc90 76.83,17.73 L1.2 | 76.96,17.27 L1.2 | C17.1 73.44,13.76
  Top 0.61: J1.4 73.44,7.74 C17.1 73.44,14.39 74.93,15.88 75.56,15.88 76.2,15.88 76.83,16.51 76.83,17.73
N$20
  Top 0.508: L2.2 73.76,17.83
  Top 0.61: J1.3 71.33,8.38 C18.2 71.33,14.13 73.76,16.56 73.76,17.83
N$21
  Top 0.508: L3.2 69.88,17.75 | 69.88,17.75 69.85,17.73 | 69.88,17.75 69.88,17.39 69.85,17.36
  Top 0.61: J1.2 65.83,8.36 C19.1 65.83,14.39 66.67,15.24 68.47,15.24 arc45 68.65,15.31 69.98,16.64 L3.2
N$22
  Top 0.508: 66.8,17.27 L4.2
  Top 0.61: J1.1 63.72,7.76 C20.2 63.72,14.19 66.8,17.27
N$23
  Top 0.152: R13.1 59.78,63.93
  Top 0.508: R13.1 R14.1 | 59.78,63.93 JMP2.3
N$25
  Top 1.016: 6.99,66.67 6.99,76.83 17.78,76.83
N$27
  Top 1.016: 26.04,75.11 26.04,65.41 10.9,65.41
N$28  (via drill 0.35)
  Top 0.406: JMP1.2 v45.72,50.16 | 43.23,32.77 43.39,32.63 | 43.39,32.63 44.57,31.63 IC2.3 | v43.18,50.16 43.18,32.84 43.39,32.63
  Bottom 0.406: v43.18,50.16 v45.72,50.16
N$63  (via drill 0.35)
  Top 0.406: 3V3.P$3 71.5,69.22 71.16,69.56 67.31,69.56 | S1.7 37.95,68.73 38.73,67.94 49.92,67.94 51.53,69.56 R9.2 67.31,69.56 | U$2.1 103.1,72.06 v103.12,72.08 | v99.06,73.03 v78.74,73.03 | v68.58,73.03 67.31,71.75 67.31,69.56
  Bottom 0.406: v103.12,72.08 102.18,73.03 v99.06,73.03 | v78.74,73.03 v68.58,73.03
N$64
  Top 0.406: 3V3.P$6 L5.1
  Top 0.457: L5.1
N$65
  Top 0.406: R8.1 52.07,71.22 50.27,73.03 36.83,73.03 S1.8
N$66
  Top 0.305: 88.5,66.02 R10.1 88.86,66.42
  Top 0.406: R11.1 88.5,66.02 90.78,66.02 92.75,67.98 U$2.5
OUTNL
  Top 0.406: IC1.23 74.64,23.71 74.78,23.57 75.62,23.57 75.97,23.22 75.97,21.08 75.63,20.74 C15.1
  Top 0.61: L2.1 75.56,19.01 74.93,19.65 C15.1
OUTNR
  Top 0.406: IC1.20 72.69,23.71 72.54,23.57 71.75,23.57 71.3,23.11 arc45 71.27,23.05 71.27,21.21 71.74,20.74 C16.1
  Top 0.61: L3.1 71.75,19.32 72.39,19.95 C16.1
OUTPL
  Top 0.406: IC1.25 75.94,24.05 76.86,23.12 76.86,21.11 77.23,20.74 C13.1
  Top 0.61: L1.1 78.74,18.74 78.11,19.38 C13.1
OUTPR
  Top 0.406: IC1.18 71.39,24.98 71.39,24 arc45 71.36,23.99 70.23,22.86 70.23,21.21 69.94,20.74 C14.1
  Top 0.61: L4.1 68.58,19.22 69.22,19.85 C14.1
PVCC  (via drill 0.35)
  Top 0.406: IC1.15 69.94,24.99 IC1.16 | IC1.27 IC1.28
  Top 0.813: 83.19,66.04 83.19,60.33 | 83.19,60.33 83.19,57.78 | 83.19,57.78 83.19,52.07 | C11.1 83.19,57.78 | C12.1 83.19,52.07 | C10.1 83.19,60.33 | R10.2 83.19,66.04 | 77.37,25 IC1.28 v79.27,25 80.88,25 83.19,27.3 83.19,52.07 | 69.95,25 69.94,24.99 v68.07,24.99 66.67,26.39 R1.1 | 83.19,66.04 83.19,69.85 84.45,71.12 88.9,71.12 | U$2.4 97.99,70.28 97.16,71.12 88.9,71.12 | 88.9,71.12 TP1.TP
  Bottom 0.813: v68.07,24.99 79.25,24.99 arc45 v79.27,25
PWRGOOD  (via drill 0.35)
  Top 0.254: v70.48,62.23 71.5,63.25 3V3.P$7 | v73.28,62.23 R7.2
  Bottom 0.254: v70.48,62.23 v73.28,62.23
RINN
  Top 0.406: C3.1 70.48,38.1 71.12,37.47 71.39,37.2 IC1.11
RINP
  Top 0.406: C4.1 69.62,36.2 70.73,35.08 IC1.12
SAMP  (via drill 0.35)
  Top 0.406: R17.1 106.05,76.83 106.68,76.2 R18.2 107.91,70.06 108.58,69.39 108.58,53.34 107.59,52.35 98.07,52.35 95.89,50.16 v95.89,37.47 | v96.52,12.06 96.52,9.53 97.79,8.26 T3_2.14/A0 | v95.89,32.38 95.89,20.42 v96.27,20.04
  Bottom 0.406: v95.89,37.47 v95.89,32.38 | v96.27,20.04 96.52,19.79 v96.52,12.06
SHUTDOWN  (via drill 0.35)
  Top 0.406: R15.1 80.64,33.66 81.21,33.09 arc-45 81.28,32.91 v81.28,31.11
  Bottom 0.406: v81.28,31.11 T3_2.2
SPKR_L+
  Top 0.406: IC2.4 47.55,33.02 45.09,33.02 44.45,33.66 44.45,52.7 45.97,54.23 J2.20 62.62,54.23 64.14,52.71 64.14,52.07 | C1.1 65.41,41.91 64.14,43.18 64.14,52.07 | TP4.TP 64.14,52.07
SPKR_L-
  Top 0.406: C2.1 64.14,40.01 62.87,41.27 62.87,50.16 61.34,51.69 J2.19 51.74,51.69 JMP1.3 48.47,51.87 TP5.TP
SPKR_R+
  Top 0.406: C4.2 64.14,36.2 60.33,40.01 | IC2.5 46.41,34.23 45.72,34.92 45.72,45.72 46.61,46.61 J2.17 58.8,46.61 60.33,45.09 60.33,40.01 | TP7.TP 60.33,40.01
SPKR_R-  (via drill 0.35)
  Top 0.406: JMP1.1 53.55,48.47 54.23,49.15 J2.18 60.07,49.15 61.59,47.62 61.59,40.64 v64.14,38.1 C3.2
  Bottom 0.406: v64.14,38.1 64.14,43.18 66.04,45.09 TP8.TP
STATE  (via drill 0.35)
  Top 0.406: v87.63,8.89 87.63,3.81 86.36,2.54 21.59,2.54 17.14,6.99 J6.6 | v87.63,14.61 87.63,19.68 86.36,20.95 T3_2.6
  Bottom 0.406: v87.63,8.89 v87.63,14.61
TCS  (via drill 0.35)
  Top 0.406: v103.5,28.57 v103.5,25.4
  Bottom 0.406: J4.4 106.68,25.4 106.05,25.4 v103.5,25.4 | T3_2.22/A8 v103.5,28.57
TIRQ  (via drill 0.35)
  Top 0.406: v97.79,19.68 97.79,30.48 98.42,31.11 T3_2.23/A9
  Bottom 0.406: J4.1 109.22,17.14 99.06,17.14 97.79,18.41 v97.79,19.68
UART_RTS
  Top 0.406: J3.8 26.04,24.13
UART_RX
  Top 0.406: 31.5,16.13 J3.5 | IC2.20 32,36.83 31.5,36.32 31.5,16.13 | T3_2.8 83.82,15.88 83.19,15.24 83.19,4.45 81.92,3.17 33.38,3.17 31.61,4.94 31.5,5.05 31.5,16.13
UART_TX  (via drill 0.35)
  Top 0.406: J3.6 v29.84,18.67 29.84,36.83 31.11,38.1 33.61,38.1 | T3_2.7 83.19,18.41 82.58,17.8 82.58,5.11 81.28,3.81 33.66,3.81 32.26,5.21 32.26,18.16 v32.77,18.67
  Top 0.508: IC2.19 33.61,38.1
  Bottom 0.406: v32.77,18.67 v29.84,18.67
VIN
  Top 0.152: 76.45,62.27 R7.1
  Top 0.254: 3V3.P$2 3V3.P$1 72.27,68.71
  Top 0.406: 54.98,77.1 54.98,76.83 R8.2 | 73.03,70.87 72.65,70.87 72.27,70.48
  Top 0.508: 72.52,70.87 73.03,70.87 74.83,70.87 76.45,69.22 76.45,62.27
  Top 0.813: C7.1 72.28,72.76 72.27,72.75 72.27,70.48 72.27,68.71
  Top 1.016: U$2.2 101.4,74.5 99.06,76.83 | U$1.P$2 20.16,74.03 22.96,76.83 54.98,76.83 72.39,76.83 | 72.39,76.83 88.9,76.83 | 88.9,76.83 99.06,76.83 | 72.39,76.83 72.16,76.6 C7.1 | 88.9,76.83 TP3.TP | R17.2 99.06,76.83

### Text on the board
tPlace: VIN | 10uF | 360K | 68K | PVCC | 39K | 200K | 68K | 360K | XT-60 Connector | 56K | 10K | 48K | 11.1V | GND | IND | 1nF | JB? | 100nF | 10uF | SPKR_L- | SPKR_L+ | NCP59302 | 1uF | 33K | JB? | 100uF | 10R | SPKR_R- | 3V3 | EN? | 1uF | SPKR_R+ | NC | 10K | Shenzen | 3V3 | 1uF | 10R | 33K | HC05 | 39K | T3.1/T3.2 | 1uF | 56K | >3V3 ONLY< | 220nF | FB | RN52 | 1nF | BTS | R+ | R- | L- | L+ | v2.0 | RN52L | RN52R
bPlace: Working? | REAR | C - 05/2018